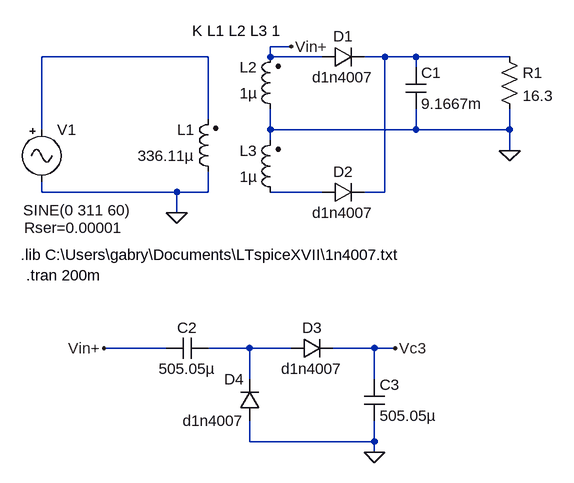
[diagram p0: schematic filtro.asc]
filtro.asc, the LTspice schematic file:
Version 4
SHEET 1 904 680
WIRE 480 16 448 16
WIRE 352 32 96 32
WIRE 448 32 448 16
WIRE 528 32 448 32
WIRE 624 32 592 32
WIRE 672 32 624 32
WIRE 816 32 672 32
WIRE 672 48 672 32
WIRE 352 128 352 32
WIRE 96 144 96 32
WIRE 448 144 448 112
WIRE 672 144 672 112
WIRE 672 144 448 144
WIRE 816 144 816 112
WIRE 816 144 672 144
WIRE 448 160 448 144
WIRE 816 176 816 144
WIRE 96 240 96 224
WIRE 304 240 96 240
WIRE 352 240 352 208
WIRE 352 240 304 240
WIRE 528 240 448 240
WIRE 624 240 624 32
WIRE 624 240 592 240
WIRE 304 272 304 240
WIRE 288 480 192 480
WIRE 416 480 352 480
WIRE 480 480 416 480
WIRE 608 480 544 480
WIRE 640 480 608 480
WIRE 416 528 416 480
WIRE 608 528 608 480
WIRE 416 624 416 592
WIRE 608 624 608 592
WIRE 608 624 416 624
WIRE 608 640 608 624
FLAG 816 176 0
FLAG 304 272 0
FLAG 480 16 Vin+
FLAG 192 480 Vin+
FLAG 608 640 0
FLAG 640 480 Vc3
SYMBOL Misc\\signal 96 128 R0
WINDOW 3 -28 140 Left 2
WINDOW 123 0 0 Left 0
WINDOW 39 -27 167 Left 2
SYMATTR Value SINE(0 311 60)
SYMATTR SpiceLine Rser=0.00001
SYMATTR InstName V1
SYMBOL ind2 368 224 R180
WINDOW 0 36 80 Left 2
WINDOW 3 36 40 Left 2
SYMATTR InstName L1
SYMATTR Value 336.11µ
SYMATTR Type ind
SYMBOL ind2 464 128 R180
WINDOW 0 36 80 Left 2
WINDOW 3 36 40 Left 2
SYMATTR InstName L2
SYMATTR Value 1µ
SYMATTR Type ind
SYMBOL ind2 464 256 R180
WINDOW 0 36 80 Left 2
WINDOW 3 36 40 Left 2
SYMATTR InstName L3
SYMATTR Value 1µ
SYMATTR Type ind
SYMBOL diode 528 48 R270
WINDOW 0 32 32 VTop 2
WINDOW 3 0 32 VBottom 2
SYMATTR InstName D1
SYMATTR Value d1n4007
SYMBOL diode 528 256 R270
WINDOW 0 32 32 VTop 2
WINDOW 3 0 32 VBottom 2
SYMATTR InstName D2
SYMATTR Value d1n4007
SYMBOL cap 656 48 R0
SYMATTR InstName C1
SYMATTR Value 9.1667m
SYMBOL res 800 16 R0
SYMATTR InstName R1
SYMATTR Value 16.3
SYMBOL cap 288 496 R270
WINDOW 0 32 32 VTop 2
WINDOW 3 0 32 VBottom 2
SYMATTR InstName C2
SYMATTR Value 505.05µ
SYMBOL cap 592 528 R0
SYMATTR InstName C3
SYMATTR Value 505.05µ
SYMBOL diode 480 496 R270
WINDOW 0 32 32 VTop 2
WINDOW 3 0 32 VBottom 2
SYMATTR InstName D3
SYMATTR Value d1n4007
SYMBOL diode 432 592 R180
WINDOW 0 24 64 Left 2
WINDOW 3 24 0 Left 2
SYMATTR InstName D4
SYMATTR Value d1n4007
TEXT 328 -8 Left 2 !K L1 L2 L3 1
TEXT 64 336 Left 2 !.lib C:\\Users\\gabry\\Documents\\LTspiceXVII\\1n4007.txt
TEXT 72 368 Left 2 !.tran 200m

The netlist it stands for:
* filtro.asc
V1 N001 0 SINE(0 311 60) Rser=0.00001
L1 0 N001 336.11µ
L2 0 Vin+ 1µ
L3 N003 0 1µ
D1 Vin+ N002 d1n4007
D2 N003 N002 d1n4007
C1 N002 0 9.1667m
R1 N002 0 16.3
C2 Vin+ N004 505.05µ
C3 Vc3 0 505.05µ
D3 N004 Vc3 d1n4007
D4 0 N004 d1n4007
.model D D
.lib standard.dio
K L1 L2 L3 1
.lib C:\Users\gabry\Documents\LTspiceXVII\1n4007.txt
.tran 200m
.backanno
.end